# EAGLE design Adafruit ADG729 Dual 1-to-4 Analog Switch (EAGLE 9.6.2)
COMPANY: ADAFRUIT INDUSTRIES; DRAWN: KTOWN; REV: A
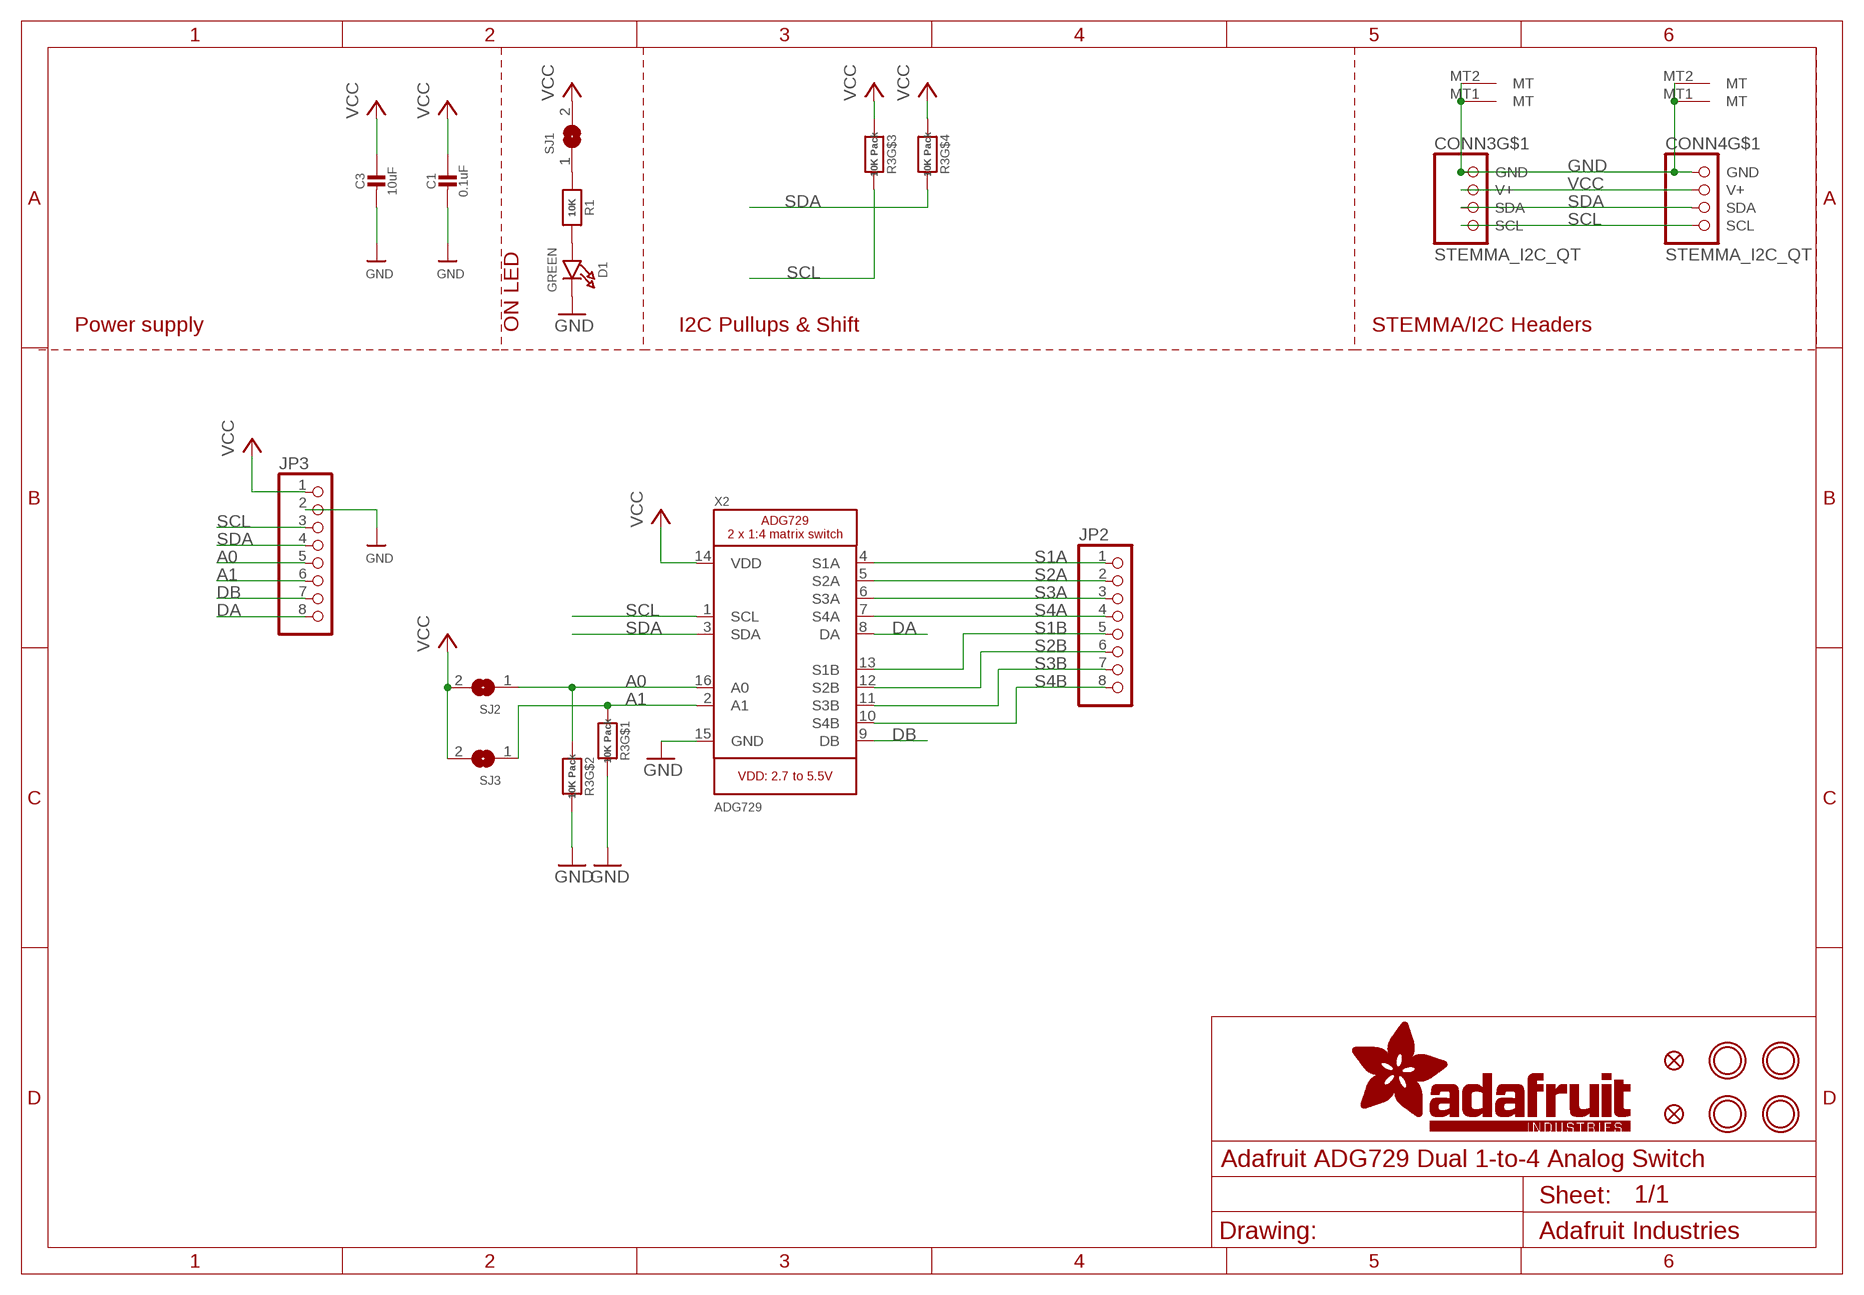
[diagram p0: schematic, sheet 1]

## Parts
C1  0.1uF  CAP_CERAMIC0603_NO  [0603-NO]
C3  10uF  CAP_CERAMIC0805-NOOUTLINE  [0805-NO]
CONN3  STEMMA_I2C_QT  [JST_SH4]
CONN4  STEMMA_I2C_QT  [JST_SH4]
D1  GREEN  LED0603_NOOUTLINE  [CHIPLED_0603_NOOUTLINE]
FID3  FIDUCIAL_1MM  [FIDUCIAL_1MM]
FID4  FIDUCIAL_1MM  [FIDUCIAL_1MM]
JP2  HEADER-1X870MIL  [1X08_ROUND_70]
JP3  HEADER-1X870MIL  [1X08_ROUND_70]
R1  10K  RESISTOR_0603_NOOUT  [0603-NO]
R3  10K Pack  RESISTOR_4PACK  [RESPACK_4X0603]
SJ1  SOLDERJUMPERCLOSED  [SOLDERJUMPER_CLOSEDWIRE]
SJ2  SOLDERJUMPER  [SOLDERJUMPER_ARROW_NOPASTE]
SJ3  SOLDERJUMPER  [SOLDERJUMPER_ARROW_NOPASTE]
U$1  MOUNTINGHOLE2.5  [MOUNTINGHOLE_2.5_PLATED]
U$17  MOUNTINGHOLE2.5  [MOUNTINGHOLE_2.5_PLATED]
U$19  MOUNTINGHOLE2.5  [MOUNTINGHOLE_2.5_PLATED]
U$21  MOUNTINGHOLE2.5  [MOUNTINGHOLE_2.5_PLATED]
X2  ADG729  [TSSOP16]

## Nets
A0: JP3.5 R3.2 SJ2.1 X2.16(A0)
A1: JP3.6 R3.1 SJ3.1 X2.2(A1)
DA: JP3.8 X2.8(DA)
DB: JP3.7 X2.9(DB)
GND [highpower]: C1.2 C3.2 CONN3.1(GND) CONN3.MT1(MT) CONN3.MT2(MT) CONN4.1(GND) CONN4.MT1(MT) CONN4.MT2(MT) D1.C JP3.2 R3.7 R3.8 X2.15(GND)
N$1: D1.A R1.2
N$2 [lowpower]: R1.1 SJ1.1
S1A: JP2.1 X2.4(S1A)
S1B: JP2.5 X2.13(S1B)
S2A: JP2.2 X2.5(S2A)
S2B: JP2.6 X2.12(S2B)
S3A: JP2.3 X2.6(S3A)
S3B: JP2.7 X2.11(S3B)
S4A: JP2.4 X2.7(S4A)
S4B: JP2.8 X2.10(S4B)
SCL: CONN3.4(SCL) CONN4.4(SCL) JP3.3 R3.6 X2.1(SCL)
SDA: CONN3.3(SDA) CONN4.3(SDA) JP3.4 R3.5 X2.3(SDA)
VCC [highpower]: C1.1 C3.1 CONN3.2(V+) CONN4.2(V+) JP3.1 R3.3 R3.4 SJ1.2 SJ2.2 SJ3.2 X2.14(VDD)

## Notes on the sheet
- Power supply | ON LED | I2C Pullups & Shift | STEMMA/I2C Headers

## Library data of the parts
C1 C3 = microbuilder:CAP_CERAMIC: Ceramic Capacitors For new designs, use the packages preceded by an '_' character since they are more reliable: The following footprints should be used on most boards: _0402 - Standard footprint for regular board layouts _0603 - Standard footprint for regular board layouts _0805 - Standard footprint for regular board layouts _1206 - Standard footprint for regular board layouts For extremely tight-pitch boards where space is at a premium, the following 'micro-pitch' footprints can be used (smaller pads, no silkscreen outline, etc.): _0402MP - Micro-pitch footprint for very dense/compact boards _0603MP - Micro-pitch footprint for very dense/compact boards _0805MP - Micro-pitch footprint for very dense/compact boards _1206MP - Micro-pitch footprint for very dense/compact boards
CONN3 CONN4 = adafruit_electromech:STEMMA_I2C; LCSC: C2845363
D1 = microbuilder:LED: LED 0603 - 0603 Surface Mount Package 2mA: Green LED - Low Power (3.9mcd, 2ma, 1.7Vf) - Digikey: 475-2709-2-ND Orange LED - Low Power (9.8mcd, 2ma, 1.8Vf) - Digikey: 475-1194-2-ND Red LED - Low Power (5mcd, 2ma, 1.8Vf) - Digikey: 475-1195-2-ND Yellow LED - Low Power (7mcd, 2ma, 1.8Vf) - Digikey: 475-1196-2-ND 5mA: Blue LED - Low Power (17mcd, 5ma, 2.9Vf) - Digikey: LNJ937W8CRACT-ND 0805 - 0805 Surface Mount Package 2mA: Red LED (8.8mcd, 2mA, 1.8Vf, Clear) - Low Power [Digikey: 475-2510-1-ND] Green LED (5mcd, 2mA, 1.8Vf, Clear) - Low Power [Digikey: 475-2730-1-ND] Yellow LED (11.3mcd, 2mA, 1.8Vf, Clear) - Low Power [Digikey: 475-2555-1-ND] 20mA: Red LED (104mcd, 20mA, Diffused) - LS R976 [Digikey: 475-1278-6-ND] Red LED (12mcd, 20mA, 2.0Vf, Clear) - APT2012EC [Digikey: 754-1128-1-ND] Green LED (15mcd, 20mA, 2.2Vf, Clear) - APT2012GC [Digikey: 754-1131-1-ND] Orange LED (160mcd, 20mA, 2.1Vf, Clear) - APT2012SECK [Digikey: 754-1130-1-ND] 1206 - 1206 Surface Mount Package Green LED (26mcd, 20mA, Diffused) - LG N971 [Digikey: 475-1407-6-ND] Red LED (15mcd, 20mA, Diffused) - LH N974 [Digikey: 475-1416-6-ND] Cree - Cree High-Power Surface Mount LEDs XPEBWT-L1-0000-00D50 - White 111lm 350mA 2.9Vf 6200K 110° XTEAWT-00-0000-00000LEE3 - White 114lm 350mA 2.85Vf 5000K 115° Everlight - Everlight 45-21 Series Surface Mount LEDs 45-21/QK2C-B2832AC2CB2/2T - Warm White 2000mcd 20mA 3.25Vf 3050K 120° 45-21/LK2C-B38452C4CB2/2T - Nuetral White 2000mcd 20mA 3.25Vf 4150K 120° 45-21/LK2C-B50634C6CB2/2T - Cold White 2200mcd 20mA 3.25Vf 5650K 120° PLCC2 Reverse Mount LS T77K-J1L2-1-0-2-R18-Z - Red 11.25mcd 2mA 1.8Vf 630nm 120° LO T77K-L1M2-24-Z - Orange 19.6mcd 2mA 1.8Vf 606nm 120° LY T77K-K2M1-26-Z - Yellow 15.7mcd 2mA 1.8Vf 587nm 120°; ROT: 270
FID3 FID4 = microbuilder:FIDUCIAL: Fiducial Alignment Points Various fiducial points for machine vision alignment.; BOM: EXCLUDE
JP2 JP3 = microbuilder:HEADER-1X8: PIN HEADER
R1 = microbuilder:RESISTOR: Resistors For new designs, use the packages preceded by an '_' character since they are more reliable: The following footprints should be used on most boards: _0402 - Standard footprint for regular board layouts _0603 - Standard footprint for regular board layouts _0805 - Standard footprint for regular board layouts _1206 - Standard footprint for regular board layouts For extremely tight-pitch boards where space is at a premium, the following 'micro-pitch' footprints can be used (smaller pads, no silkscreen outline, etc.): _0402MP - Micro-pitch footprint for very dense/compact boards _0603MP - Micro-pitch footprint for very dense/compact boards _0805MP - Micro-pitch footprint for very dense/compact boards _1206MP - Micro-pitch footprint for very dense/compact boards
R3 = microbuilder:RESISTOR_4PACK: Resistor Packs (4 resistors) 4 x 0603 10K 1/16W - Digikey: YC164J-10KCT-ND
SJ1 = microbuilder:SOLDERJUMPER: SMD Solder JUMPER Solder the two pads together to create a connection, or remove the solder to break it. REFLOW - Use this footprint for solder paste and reflow ovens. WAVE - Use this footprint for hand-soldering (larger pads). CLOSED - Has a trace between the two pads to ensure it is closed by default. The trace needs to be cut to disable the jumper, and can be closed again by creating a solder bridge between the two pads.
SJ2 SJ3 = microbuilder:SOLDERJUMPER: SMD Solder JUMPER Solder the two pads together to create a connection, or remove the solder to break it. REFLOW - Use this footprint for solder paste and reflow ovens. WAVE - Use this footprint for hand-soldering (larger pads). CLOSED - Has a trace between the two pads to ensure it is closed by default. The trace needs to be cut to disable the jumper, and can be closed again by creating a solder bridge between the two pads.; BOM: EXCLUDE
U$1 U$17 U$19 U$21 = adafruit_electromech:MOUNTINGHOLE: Mounting Hole For #2 screws (0.086"/2.18mm width, 0.094"/2.4mm hole) use 2.5mm; BOM: EXCLUDE
X2 = microbuilder:ADG729

## Net classes
1 highpower: width 0.305 mm, drill 0.483 mm
2 lowpower: width 0.254 mm, drill 0.483 mm

## Board
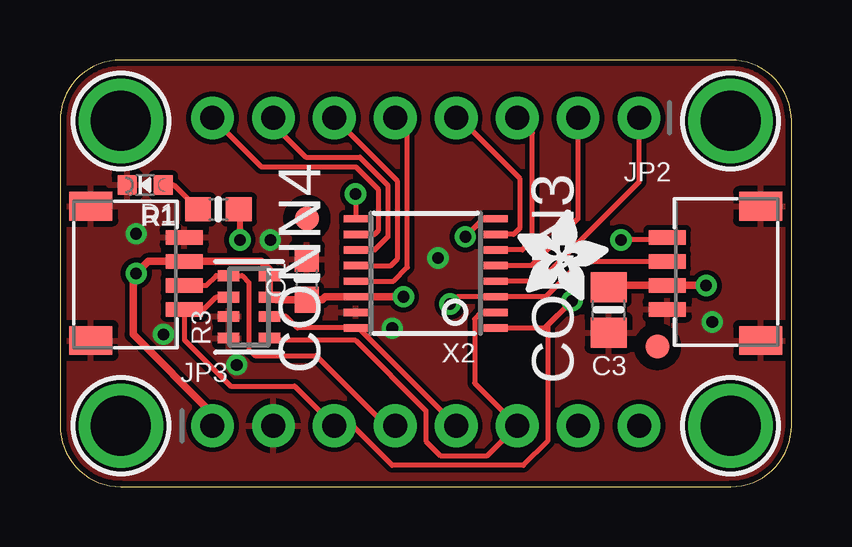
[diagram p1: board, top side]
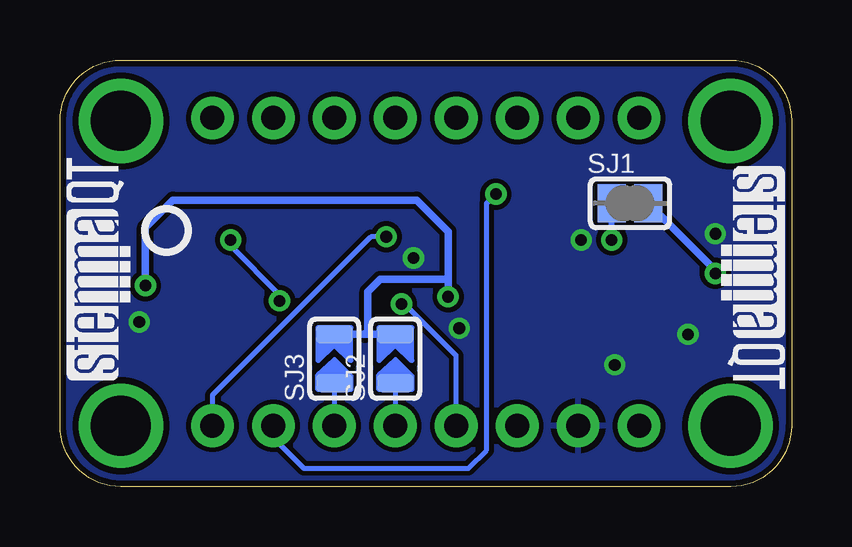
[diagram p2: board, bottom side, seen from below]

Size 30.48 x 17.78 mm. Coordinates in mm from the lower left corner, seen from the top.
Outline: 0,15.24 0,2.54 arc90 2.54,0 27.94,0 arc90 30.48,2.54 30.48,15.24 arc90 27.94,17.78 2.54,17.78 arc90 0,15.24
Copper layers (1*16): Top 0.035mm / dielectric 1.5mm / Bottom 0.035mm
Design rules "adafruit *": minimum track width 8mil, minimum drill 15.5mil, track to track 8mil, track to pad 8mil, pad to pad 8mil, via to via 8mil, smd to smd 8mil, copper to edge 10mil, drill to drill 8mil, minimum pad ring 10mil, minimum via ring 8mil, stop-mask expansion 2mil, vias tented up to drill 20mil, thermal gap 10mil

### Footprints (pad centres in the part's own frame; a part is rotated, then mirrored left to right if it is on the bottom)
0603-NO = smd 1.075 x 1: 1 -0.85,0; 2 0.85,0
0805-NO = smd 1.24 x 1.5: 1 -0.95,0; 2 0.95,0
JST_SH4 = smd 0.6 x 1.55: 1 -1.5,2.006; 2 -0.5,2.006; 3 0.5,2.006; 4 1.5,2.006 | smd 1.2 x 1.8: MT1 -2.8,-1.894; MT2 2.8,-1.894
CHIPLED_0603_NOOUTLINE = smd 0.8 x 0.8: A 0,-0.75; C 0,0.75
FIDUCIAL_1MM = smd 1 x 1: 1 0,0
1X08_ROUND_70 = drill 1 pad 1.778: 1 -8.89,0; 2 -6.35,0; 3 -3.81,0; 4 -1.27,0; 5 1.27,0; 6 3.81,0; 7 6.35,0; 8 8.89,0
RESPACK_4X0603 = smd 0.45 x 0.9: 1 -1.3,-0.85; 2 -0.4,-0.85; 3 0.4,-0.85; 4 1.3,-0.85; 5 1.3,0.85; 6 0.4,0.85; 7 -0.4,0.85; 8 -1.3,0.85
SOLDERJUMPER_CLOSEDWIRE = smd 1.168 x 1.6: 1 -0.762,0; 2 0.762,0 | smd 0.635 x 0.203: WIRE 0,0
SOLDERJUMPER_ARROW_NOPASTE = smd 0.762 x 1.524: 1 -1.016,0; 2 1.016,0
MOUNTINGHOLE_2.5_PLATED = drill 2.5 pad 3.2: P$1 0,0
TSSOP16 = smd 0.305 x 0.991: 1 -2.275,-2.918; 2 -1.625,-2.918; 3 -0.975,-2.918; 4 -0.325,-2.918; 5 0.325,-2.918; 6 0.975,-2.918; 7 1.625,-2.918; 8 2.275,-2.918; 9 2.275,2.918; 10 1.625,2.918; 11 0.975,2.918; 12 0.325,2.918; 13 -0.325,2.918; 14 -0.975,2.918; 15 -1.625,2.918; 16 -2.275,2.918

### Placement (x,y rotation side)
C1  10.29,8.64 90 top
C3  22.86,7.37 270 top
CONN3  27.3,8.89 90 top
CONN4  3.17,8.89 270 top
D1  3.56,12.57 90 top
FID3  10.29,11.18 0 top
FID4  24.89,5.84 0 top
JP2  15.24,15.37 180 top
JP3  15.24,2.54 0 top
PLABEL0  [PLABEL0]  6.35,0.89 0 top
PLABEL1  [PLABEL1]  16.51,0.89 0 top
PLABEL2  [PLABEL2]  8.89,4.19 0 top
PLABEL3  [PLABEL3]  11.43,0.89 0 top
PLABEL4  [PLABEL4]  14.1,4.19 0 top
PLABEL5  [PLABEL5]  24.13,4.19 0 top
PLABEL6  [PLABEL6]  0.38,12.45 0 top
PLABEL7  [PLABEL7]  18.92,4.06 0 top
PLABEL8  [PLABEL8]  21.59,0.89 0 top
PLABEL9  [PLABEL9]  6.35,17.02 0 top
PLABEL10  [PLABEL10]  8.89,17.02 0 top
PLABEL11  [PLABEL11]  11.43,17.02 0 top
PLABEL12  [PLABEL12]  13.97,17.02 0 top
PLABEL13  [PLABEL13]  16.51,17.02 0 top
PLABEL14  [PLABEL14]  19.05,17.02 0 top
PLABEL15  [PLABEL15]  21.59,17.02 0 top
PLABEL16  [PLABEL16]  24.13,17.02 0 top
PLABEL17  [PLABEL17]  16,13.08 0 top
PLABEL18  [PLABEL18]  15.75,0.89 0 bottom
PLABEL19  [PLABEL19]  6.6,13.59 0 bottom
PLABEL20  [PLABEL20]  16.89,10.79 0 bottom
PLABEL21  [PLABEL21]  8.64,5.33 0 bottom
PLABEL22  [PLABEL22]  14.73,5.33 90 bottom
PLABEL23  [PLABEL23]  20.95,5.33 90 bottom
R1  6.6,11.56 180 top
R3  7.87,7.49 90 top
SJ1  6.73,11.81 0 bottom
SJ2  16.51,5.33 90 bottom
SJ3  19.05,5.33 90 bottom
U$1  2.54,15.24 0 top
U$17  27.94,15.24 0 top
U$19  2.54,2.54 0 top
U$21  27.94,2.54 0 top
U$22  [ADAFRUIT_3.5MM]  19.05,7.75 0 top
U$25  [PCBFEAT-REV-040]  26.04,10.67 0 bottom
U$30  [STEMMAQT]  27.56,4.45 90 bottom
U$31  [STEMMAQT]  2.92,13.34 270 bottom
X2  15.24,8.89 90 top

### Tracks (layer width: path | path; a pad name or v marks a point on that pad's centre or on a via)
A0
  Top 0.203: JP3.5 12.44,6.62 X2.16 9.89,6.62 9.42,7.09 R3.2
  Bottom 0.203: SJ2.1 JP3.5
A1
  Top 0.203: X2.2 17.55,7.26 17.27,6.99 17.27,4.32 JP3.6 17.8,1.29 15.85,1.29 15.24,1.91 15.24,3.17 12.32,6.1 9.02,6.1 8.92,6.19 R3.1
  Bottom 0.203: SJ3.1 JP3.6
DA  (via drill 0.48)
  Top 0.203: X2.8 17.64,11.16 v16.89,10.41
  Bottom 0.203: JP3.8 24.13,3.81 17.53,10.41 v16.89,10.41
DB  (via drill 0.48)
  Top 0.203: v12.32,12.19 X2.9
  Bottom 0.203: v12.32,12.19 12.7,11.81 12.7,1.52 13.46,0.76 20.32,0.76 21.59,2.03 JP3.7
GND  (via drill 0.48)
  other vias: 3.17,10.54 8.76,10.29 7.37,5.08 4.32,6.35 27.18,6.86 15.75,9.53 13.84,6.6
  pour Top: 0,17.78 30.48,17.78 30.48,0 0,0
  pour Bottom: 0,17.78 30.48,17.78 30.48,0 0,0
N$1
  Top 0.203: D1.A 4.74,12.57 R1.2
N$2  (via drill 0.48)
  Top 0.254: R1.1 7.49,11.52 v7.49,10.29
  Bottom 0.254: v7.49,10.29 SJ1.1
S1A
  Top 0.203: JP2.1 24.13,12.7 20,8.56 X2.4
S1B
  Top 0.203: JP2.5 14.48,14.86 14.48,9.14 13.9,8.56 X2.13
S2A
  Top 0.203: JP2.2 21.59,11.18 19.63,9.21 X2.5
S2B
  Top 0.203: JP2.6 14.07,12.72 14.07,9.5 13.79,9.21 X2.12
S3A
  Top 0.203: JP2.3 19.68,14.73 19.68,10.29 19.26,9.87 X2.6
S3B
  Top 0.203: JP2.7 8.89,15.08 10.24,13.73 12.49,13.73 13.66,12.56 13.66,10.41 13.12,9.87 X2.11
S4A
  Top 0.203: JP2.4 16.64,15.37 19.18,12.83 19.18,10.79 18.9,10.52 X2.7
S4B
  Top 0.203: JP2.8 8.39,13.32 12.32,13.32 13.26,12.39 13.26,10.67 13.11,10.52 X2.10
SCL  (via drill 0.48)
  Top 0.203: R3.6 6.5,7.89 5.99,7.39 CONN4.4 5.18,6.12 7.11,4.19 9.78,4.19 JP3.3 12.19,2.54 13.84,0.89 19.3,0.89 20.32,1.91 20.32,6.73 v21.34,7.75 20.2,6.62 X2.1 | CONN3.4 25.2,10.29 v23.37,10.29
  Bottom 0.203: v23.37,10.29 23.37,10.03 21.34,8 v21.34,7.75
SDA  (via drill 0.48)
  Top 0.203: CONN4.3 6.1,8.39 6.51,8.79 R3.5 7.59,8.79 7.87,8.51 7.87,5.71 8.13,5.46 10.67,5.46 13.59,2.54 JP3.4 | CONN3.3 21.71,9.39 20.23,7.92 X2.3 16.55,7.92 v16.26,7.62
  Bottom 0.203: JP3.4 13.97,5.46 16.13,7.62 v16.26,7.62
VCC  (via drill 0.48)
  Top 0.305: R3.4 R3.3 | R3.4 8.72,8.08 9.02,7.79 C1.1 10.92,7.79 11.05,7.92 X2.14 v14.31,7.92 | R3.4 8.72,9.06 8.38,9.4 CONN4.2 3.67,9.39 v3.17,8.89 3.05,8.76 3.05,6.35 6.35,3.05 JP3.1 | C3.1 22.93,8.39 CONN3.2 v26.92,8.39 v26.92,8.38
  Bottom 0.305: v26.92,8.38 26.92,10.79 25.78,11.94 15.62,11.94 14.31,10.63 14.31,8.64 | SJ1.2 3.17,9.02 v3.17,8.89 | v14.31,7.92 14.31,8.64 | SJ2.2 17.78,6.35 | 17.78,6.35 SJ3.2 | 17.78,6.35 17.65,6.48 17.65,8.13 17.14,8.64 14.31,8.64

### Text on the board
Pinguin_tBackup: 4B | 3B | 2B | 1B | 4A | 3A | 2A | 1A | ADG729 I2C 2x1:4 Switch | on | GND | SDA | A1 | DA | VIN | SCL | A0 | DB
Pinguin_bBackup: LED | ADG729 I2C / 2x 1:4 Matrix / Analog Switches | Default I2C / Addr 0x44 | A0 | A1 | VLogic/Vcc: 3-5VDC